# Altium schematic sheet sc16is752.SchDoc
size A4
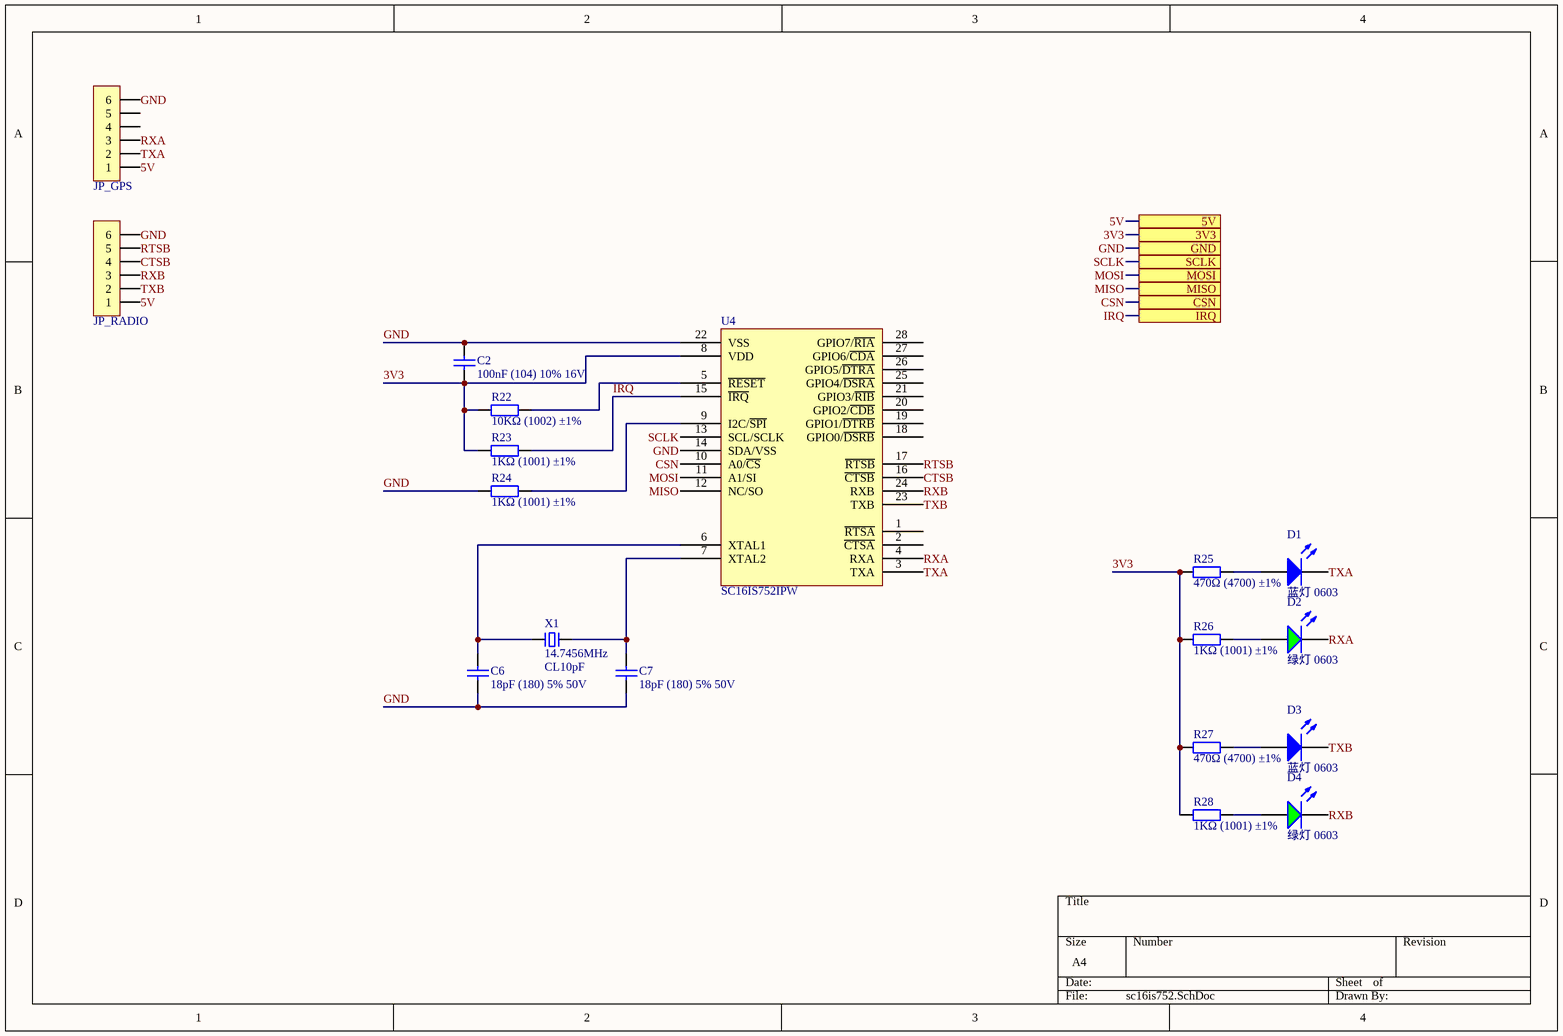
[diagram p0: sc16is752.SchDoc]

## Parts
C2  100nF (104) 10% 16V  [0402_C]
C6  18pF (180) 5% 50V  [0402_C]
C7  18pF (180) 5% 50V  [0402_C]
D1  蓝灯 0603  [0603_LED_S1]
D2  绿灯 0603  [0603_LED_S1]
D3  蓝灯 0603  [0603_LED_S1]
D4  绿灯 0603  [0603_LED_S1]
JP_GPS  HDR-1X6  [MX 1.25-WS-6P]  (value not drawn)
JP_RADIO  HDR-1X6  [MX 1.25-WS-6P]  (value not drawn)
R22  10KΩ (1002) ±1%  [0402_R]
R23  1KΩ (1001) ±1%  [0402_R]
R24  1KΩ (1001) ±1%  [0402_R]
R25  470Ω (4700) ±1%  [0402_R]
R26  1KΩ (1001) ±1%  [0402_R]
R27  470Ω (4700) ±1%  [0402_R]
R28  1KΩ (1001) ±1%  [0402_R]
U4  SC16IS752IPW  [TSSOP28_n]
X1  14.7456MHz  负载电容: CL10pF  [OSC HC-49SMD]

## Ports
3V3, 5V, CSN, GND, IRQ, MISO, MOSI, SCLK

## Nets
3V3: C2.1 R22.1 R23.1 R25.1 R26.1 R27.1 R28.1 U4.8(VDD) ; port 3V3
5V: JP_GPS.1 JP_RADIO.1 ; port 5V
CSN: U4.10(A0/~{CS}) ; port CSN
CTSB: JP_RADIO.4 U4.16(~{CTSB})
GND: C2.2 C6.1 C7.1 JP_GPS.6 JP_RADIO.6 R24.1 U4.14(SDA/VSS) U4.22(VSS) ; port GND
IRQ: R23.2 U4.15(~{IRQ}) ; port IRQ
MISO: U4.12(NC/SO) ; port MISO
MOSI: U4.11(A1/SI) ; port MOSI
RTSB: JP_RADIO.5 U4.17(~{RTSB})
RXA: D2.K JP_GPS.3 U4.4(RXA)
RXB: D4.K JP_RADIO.3 U4.24(RXB)
SCLK: U4.13(SCL/SCLK) ; port SCLK
TXA: D1.K JP_GPS.2 U4.3(TXA)
TXB: D3.K JP_RADIO.2 U4.23(TXB)
NetC6_2: C6.2 U4.6(XTAL1) X1.1
NetC7_2: C7.2 U4.7(XTAL2) X1.2
NetD1_A: D1.A R25.2
NetD2_A: D2.A R26.2
NetD3_A: D3.A R27.2
NetD4_A: D4.A R28.2
NetR22_2: R22.2 U4.5(~{RESET})
NetR24_2: R24.2 U4.9(I2C/~{SPI})

Not connected (* = marked no-connect by the designer): JP_GPS 4 5; U4 1(~{RTSA}) 2(~{CTSA}) 18(GPIO0/~{DSRB}) 19(GPIO1/~{DTRB}) 20(GPIO2/~{CDB}) 21(GPIO3/~{RIB}) 25(GPIO4/~{DSRA}) 26(GPIO5/~{DTRA}) 27(GPIO6/~{CDA}) 28(GPIO7/~{RIA})

## Library data of the parts
C2 = 0402 100nF (104) 10% 16V: 贴片电容; ComponentLink1Description: 供应商链接; ComponentLink1URL: http://www.szlcsc.com/product/details_1877.html; Package: 0402; Supplier: LC; SuppliersPartNumber: C1525
C6 C7 = 0402 18pF (180) 5% 50V: 贴片电容; ComponentLink1Description: 供应商链接; ComponentLink1URL: http://www.szlcsc.com/product/details_1901.html; Package: 0402; Supplier: LC; SuppliersPartNumber: C1549
D1 D3 = 0603 蓝灯: 发光二极管; ComponentLink1Description: 供应商链接; ComponentLink1URL: http://www.szlcsc.com/product/details_73150.html; Package: 0603; Supplier: LC; SuppliersPartNumber: C72041
D2 D4 = 0603 绿灯: 发光二极管; ComponentLink1Description: 供应商链接; ComponentLink1URL: http://www.szlcsc.com/product/details_73152.html; Package: 0603; Supplier: LC; SuppliersPartNumber: C72043
JP_GPS JP_RADIO = Header 6: 6P接插件; 版权归属: 源创客; BOM名称: 6P接插件; 学习资源: www.ooocke.com
R22 = 0402 10KΩ (1002) 1%: 贴片电阻; ComponentLink1Description: 供应商链接; ComponentLink1URL: http://www.szlcsc.com/product/details_26487.html; Package: 0402; Supplier: LC; SuppliersPartNumber: C25744
R23 R24 R26 R28 = 0402 1KΩ (1001) 1%: 贴片电阻; ComponentLink1Description: 供应商链接; ComponentLink1URL: http://www.szlcsc.com/product/details_12256.html; Package: 0402; Supplier: LC; SuppliersPartNumber: C11702
R25 R27 = 0402 470Ω (4700) 1%: 贴片电阻; ComponentLink1Description: 供应商链接; ComponentLink1URL: http://www.szlcsc.com/product/details_25860.html; Package: 0402; Supplier: LC; SuppliersPartNumber: C25117
X1 = XTAL-2P: 2脚无源脚晶振; 版权归属: 源创客; BOM名称: 2脚无源脚晶振; 学习资源: www.ooocke.com